# Altium schematic sheet MIDI_Kontakter.SchDoc
size A4
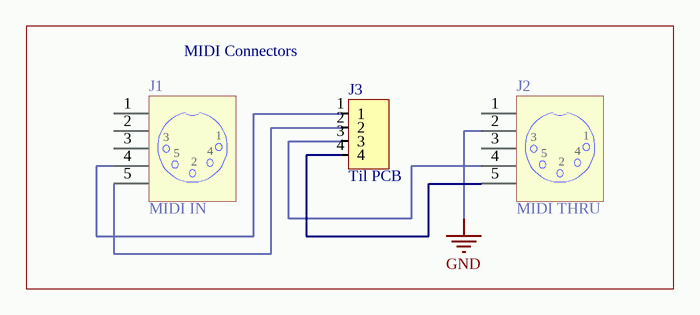
[diagram p0: MIDI_Kontakter.SchDoc]

## Parts
J1  MIDI IN  [KONV-KMFCDIN76005_V]
J2  MIDI THRU  [KONV-KMFCDIN76005_V]
J3  Til PCB  [JST 4pin]

## Blocks framed on the sheet
MIDI Connectors: J1-J3

## Nets
GND: J2.2
NetJ1_4: J1.4 J3.1
NetJ1_5: J1.5 J3.2
NetJ2_4: J2.4 J3.3
NetJ2_5: J2.5 J3.4

Not connected (* = marked no-connect by the designer): J1 1 2 3 MH1 MH2; J2 1 3 MH1 MH2

## Library data of the parts
J1 J2 = CMP-0406-00001-1: Socket, 5-way R/A DIN; Manufacturer: Konvee Electronic; PartNumber: KMFCDIN76005; PackageDescription: Socket, 5-way R/A DIN; PackageReference: KMFCDIN76005; Mounting Technology: Through Hole; ComponentLink1Description: Manufacturer URL; ComponentLink1URL: http://www.konvee.com/
J3 = JST 4pin